# Altium schematic sheet EXPANDER_I2C.SchDoc: EXPANDER I2C
size A4; Author: Silvio Navaretti; CompanyName: Arduino SRL; DrawnBy: Silvio Navaretti; Engineer: Silvio Navaretti; Organization: Arduino SRL; DocumentNumber: ASX00083; SheetNumber: 5; SheetTotal: 11; RevAuthor: Silvio Navaretti
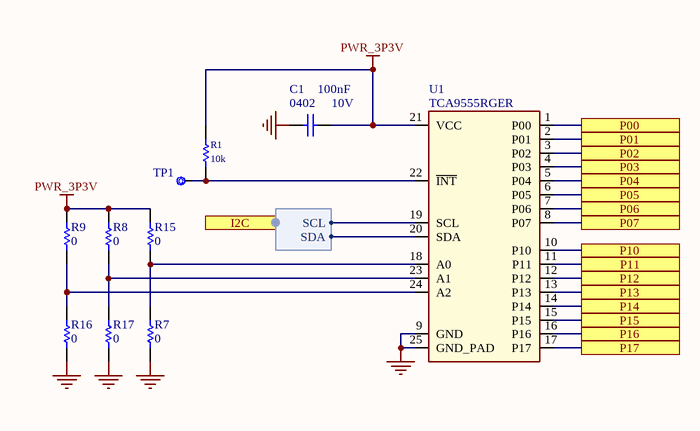
[diagram p0: EXPANDER_I2C.SchDoc]

## Parts
C1  value 100nF  Case Code (Imperial): 0402  Voltage: 10V  [CAP-0402]  (hidden comment: GRM155R61A104KA01J)
R1  value 10k  [RES-0402]  (hidden comment: CRCW040210K0FKED)
R7  value 0  [RES-0402]  (hidden comment: CRCW04020000Z0EDC)
R8  value 0  [RES-0402]  (hidden comment: CRCW04020000Z0EDC)
R9  value 0  [RES-0402]  (hidden comment: CRCW04020000Z0EDC)
R15  value 0  [RES-0402]  (hidden comment: CRCW04020000Z0EDC)
R16  value 0  [RES-0402]  (hidden comment: CRCW04020000Z0EDC)
R17  value 0  [RES-0402]  (hidden comment: CRCW04020000Z0EDC)
TP1  Test point 1.00mm  [TP-1.00MM]  (value not drawn)  (no BOM)
U1  TCA9555RGER  [PQFN50P400X400X100_HS-25N]

## Ports
I2C (harness I2C), P00, P01, P02, P03, P04, P05, P06, P07, P10, P11, P12, P13, P14, P15, P16, P17

## Harnesses
I2C: SDA, SCL

## Nets
GND: C1.1 R7.2 R16.2 R17.2 U1.9(GND) U1.25(GND_PAD)
PWR_3P3V: C1.2 R1.2 R8.1 R9.1 R15.1 U1.21(VCC)
P00: U1.1(P00) ; port P00
P01: U1.2(P01) ; port P01
P02: U1.3(P02) ; port P02
P03: U1.4(P03) ; port P03
P04: U1.5(P04) ; port P04
P05: U1.6(P05) ; port P05
P06: U1.7(P06) ; port P06
P07: U1.8(P07) ; port P07
P10: U1.10(P10) ; port P10
P11: U1.11(P11) ; port P11
P12: U1.12(P12) ; port P12
P13: U1.13(P13) ; port P13
P14: U1.14(P14) ; port P14
P15: U1.15(P15) ; port P15
P16: U1.16(P16) ; port P16
P17: U1.17(P17) ; port P17
NetR1_1: R1.1 TP1.X U1.22(~{INT})
NetR7_1: R7.1 R15.2 U1.18(A0)
NetR8_2: R8.2 R17.1 U1.23(A1)
NetR9_2: R9.2 R16.1 U1.24(A2)
NetU1_19: U1.19(SCL) ; port I2C.SCL
NetU1_20: U1.20(SDA) ; port I2C.SDA

## Notes on the sheet
- Title:
- ID:
- Date:
- Time:
- Version:
- Sheet
- of
- RevAuthor:
- Reference Designs ARE PROVIDED "AS IS" AND "WITH ALL FAULTS. Arduino SA DISCLAIMS ALL OTHER WARRANTIES, EXPRESS OR IMPLIED, REGARDING PRODUCTS, INCLUDING BUT NOT LIMITED TO, ANY IMPLIED WARRANTIES OF MERCHANTABILITY OR FITNESS FOR A PARTICULAR PURPOSE.
  Arduino SA may make changes to specifications and product descriptions at any time, without notice. The Customer must not rely on the absence or characteristics of any features or instructions marked "reserved" or "undefined". Arduino SA reserves these for future definition and shall have no responsibility whatsoever for conflicts or incompatibilities arising from future changes to them. The product information on the Web Site or Materials is subject to change without notice.
  Do not finalize a design with this info. ARDUINO and other Arduino brands and logos and Trademarks of Arduino SA. All Arduino SA Trademarks cannot be used without owner's formal permission.
- File:
- Author:

## Library data of the parts
C1 = C0134-A.4: CAP CHIP 0402 100nF 10% 10V X5R; Manufacturer: Murata; Code Arduino: C0134; Part Number: GRM155R61A104KA01J; Technology: Ceramic; Manufacturer 2: Walsin; Tolerance: 10%; Dielectric: X5R
R1 = R0003-A.24: RES CHIP 0402 10k 1% 1/16W; Manufacturer: Vishay; Code Arduino: 0136; Power: 62.5mW; Temperature coefficient: 100ppm; Case Code (Imperial): 0402; Part Number: CRCW040210K0FKED; Technology: Thick film; Tolerance: 1%
R7-R9 R15-R17 = R0000-A.24: RES CHIP 0402 0R 1/16W; Manufacturer: Vishay; Code Arduino: 0039; Power: 62.5mW; Tolerance: 0%; Temperature coefficient: 0ppm; Part Number: CRCW04020000Z0EDC; Technology: Thick film; Case Code (Imperial): 0402
TP1 = UT0013-A.6: Manufacturer: This is not a component; Source: ut.SchLib; Pin Count: 1; Design Item ID: CMP-018-0005-A.3; Part Number: This is not a component; Code Arduino: This is not a component
U1 = U0167-A.6: IC 16b I2C EXPANDER with INTERRUPT; Manufacturer: Texas Instruments; Code Arduino: U0167; Part Number: TCA9555RGER; LCSC Part #: C2869248